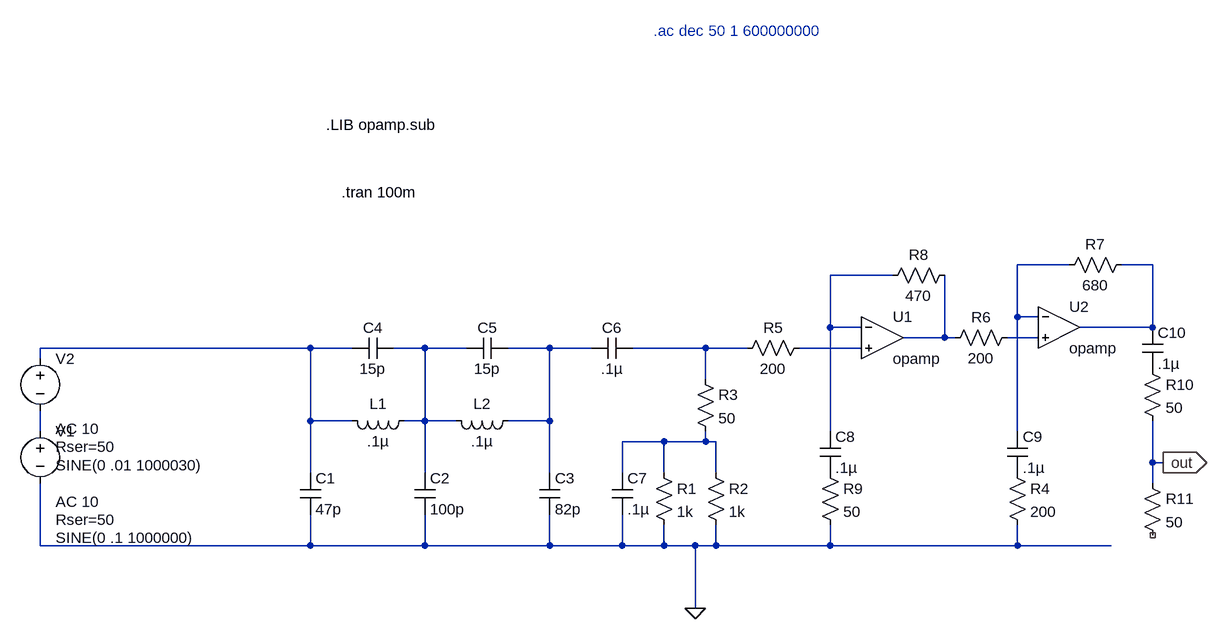
[diagram p0: schematic DDS Amp.asc]
DDS Amp.asc, the LTspice schematic file:
Version 4
SHEET 1 880 680
WIRE 592 -128 512 -128
WIRE 720 -128 672 -128
WIRE 320 -112 224 -112
WIRE 512 -48 512 -128
WIRE 544 -48 512 -48
WIRE 224 -32 224 -112
WIRE 272 -32 224 -32
WIRE 720 -32 720 -128
WIRE 720 -32 608 -32
WIRE 400 -16 400 -112
WIRE 400 -16 336 -16
WIRE 416 -16 400 -16
WIRE 544 -16 496 -16
WIRE -576 0 -992 0
WIRE -512 0 -576 0
WIRE -400 0 -448 0
WIRE -336 0 -400 0
WIRE -208 0 -272 0
WIRE -144 0 -208 0
WIRE 32 0 -80 0
WIRE 96 0 32 0
WIRE 272 0 176 0
WIRE -992 16 -992 0
WIRE 32 48 32 0
WIRE -576 112 -576 0
WIRE -512 112 -576 112
WIRE -400 112 -400 0
WIRE -400 112 -432 112
WIRE -352 112 -400 112
WIRE -208 112 -208 0
WIRE -208 112 -272 112
WIRE -992 128 -992 96
WIRE 224 128 224 -32
WIRE 512 128 512 -48
WIRE -32 144 -96 144
WIRE 32 144 32 128
WIRE 32 144 -32 144
WIRE 48 144 32 144
WIRE 720 176 720 112
WIRE 736 176 720 176
WIRE -576 192 -576 112
WIRE -400 192 -400 112
WIRE -208 192 -208 112
WIRE -96 192 -96 144
WIRE -32 192 -32 144
WIRE 48 192 48 144
WIRE 720 208 720 176
WIRE -992 304 -992 208
WIRE -576 304 -576 256
WIRE -576 304 -992 304
WIRE -400 304 -400 256
WIRE -400 304 -576 304
WIRE -208 304 -208 256
WIRE -208 304 -400 304
WIRE -96 304 -96 256
WIRE -96 304 -208 304
WIRE -32 304 -32 272
WIRE -32 304 -96 304
WIRE 16 304 -32 304
WIRE 48 304 48 272
WIRE 48 304 16 304
WIRE 224 304 224 272
WIRE 224 304 48 304
WIRE 512 304 512 272
WIRE 512 304 224 304
WIRE 656 304 512 304
WIRE 16 400 16 304
FLAG 16 400 0
FLAG 736 176 out
IOPIN 736 176 Out
SYMBOL ind -416 96 R90
WINDOW 0 5 56 VBottom 2
WINDOW 3 32 56 VTop 2
SYMATTR InstName L1
SYMATTR Value .1µ
SYMBOL ind -256 96 R90
WINDOW 0 5 56 VBottom 2
WINDOW 3 32 56 VTop 2
SYMATTR InstName L2
SYMATTR Value .1µ
SYMBOL cap -592 192 R0
SYMATTR InstName C1
SYMATTR Value 47p
SYMBOL cap -416 192 R0
SYMATTR InstName C2
SYMATTR Value 100p
SYMBOL cap -224 192 R0
SYMATTR InstName C3
SYMATTR Value 82p
SYMBOL voltage -992 112 R0
WINDOW 3 24 180 Left 2
WINDOW 123 24 124 Left 2
WINDOW 39 24 152 Left 2
SYMATTR InstName V1
SYMATTR Value SINE(0 .1 1000000)
SYMATTR Value2 AC 10
SYMATTR SpiceLine Rser=50
SYMBOL cap -448 -16 R90
WINDOW 0 0 32 VBottom 2
WINDOW 3 32 32 VTop 2
SYMATTR InstName C4
SYMATTR Value 15p
SYMBOL cap -272 -16 R90
WINDOW 0 0 32 VBottom 2
WINDOW 3 32 32 VTop 2
SYMATTR InstName C5
SYMATTR Value 15p
SYMBOL cap -80 -16 R90
WINDOW 0 0 32 VBottom 2
WINDOW 3 32 32 VTop 2
SYMATTR InstName C6
SYMATTR Value .1µ
SYMBOL res -48 176 R0
SYMATTR InstName R1
SYMATTR Value 1k
SYMBOL res 16 32 R0
SYMATTR InstName R3
SYMATTR Value 50
SYMBOL res 496 176 R0
SYMATTR InstName R4
SYMATTR Value 200
SYMBOL res 192 -16 R90
WINDOW 0 0 56 VBottom 2
WINDOW 3 32 56 VTop 2
SYMATTR InstName R5
SYMATTR Value 200
SYMBOL res 512 -32 R90
WINDOW 0 0 56 VBottom 2
WINDOW 3 32 56 VTop 2
SYMATTR InstName R6
SYMATTR Value 200
SYMBOL res 688 -144 R90
WINDOW 0 0 56 VBottom 2
WINDOW 3 32 56 VTop 2
SYMATTR InstName R7
SYMATTR Value 680
SYMBOL res 416 -128 R90
WINDOW 0 0 56 VBottom 2
WINDOW 3 32 56 VTop 2
SYMATTR InstName R8
SYMATTR Value 470
SYMBOL cap -112 192 R0
SYMATTR InstName C7
SYMATTR Value .1µ
SYMBOL res 208 176 R0
SYMATTR InstName R9
SYMATTR Value 50
SYMBOL cap 208 128 R0
SYMATTR InstName C8
SYMATTR Value .1µ
SYMBOL cap 496 128 R0
SYMATTR InstName C9
SYMATTR Value .1µ
SYMBOL res 704 16 R0
SYMATTR InstName R10
SYMATTR Value 50
SYMBOL cap 704 -32 R0
SYMATTR InstName C10
SYMATTR Value .1µ
SYMBOL res 704 192 R0
SYMATTR InstName R11
SYMATTR Value 50
SYMBOL OpAmps\\opamp 304 -80 R0
SYMATTR InstName U1
SYMATTR SpiceLine2 GBW=650Meg
SYMBOL OpAmps\\opamp 576 -96 R0
SYMATTR InstName U2
SYMATTR SpiceLine2 GBW=650Meg
SYMBOL res 32 176 R0
SYMATTR InstName R2
SYMATTR Value 1k
SYMBOL voltage -992 0 R0
WINDOW 3 24 180 Left 2
WINDOW 123 24 124 Left 2
WINDOW 39 24 152 Left 2
SYMATTR InstName V2
SYMATTR Value SINE(0 .01 1000030)
SYMATTR Value2 AC 10
SYMATTR SpiceLine Rser=50
TEXT -48 -488 Left 2 ;.ac dec 50 1 600000000
TEXT -552 -344 Left 2 !.LIB opamp.sub
TEXT -528 -240 Left 2 !.tran 100m

The netlist it stands for:
* DDS Amp.asc
L1 N007 N006 .1µ
L2 N008 N007 .1µ
C1 N006 0 47p
C2 N007 0 100p
C3 N008 0 82p
V1 N011 0 SINE(0 .1 1000000) AC 10 Rser=50
C4 N007 N006 15p
C5 N008 N007 15p
C6 N009 N008 .1µ
R1 N012 0 1k
R3 N009 N012 50
R4 P001 0 200
R5 N010 N009 200
R6 N005 N004 200
R7 N002 N001 680
R8 N004 N003 470
C7 N012 0 .1µ
R9 P002 0 50
C8 N003 P002 .1µ
C9 N001 P001 .1µ
R10 P003 out 50
C10 N002 P003 .1µ
R11 out NC_01 50
XU1 N003 N010 N004 opamp Aol=100K GBW=650Meg  ; pins invin noninvin out
XU2 N001 N005 N002 opamp Aol=100K GBW=650Meg  ; pins invin noninvin out
R2 N012 0 1k
V2 N006 N011 SINE(0 .01 1000030) AC 10 Rser=50
* .ac dec 50 1 600000000
.LIB opamp.sub
.tran 100m
.backanno
.end